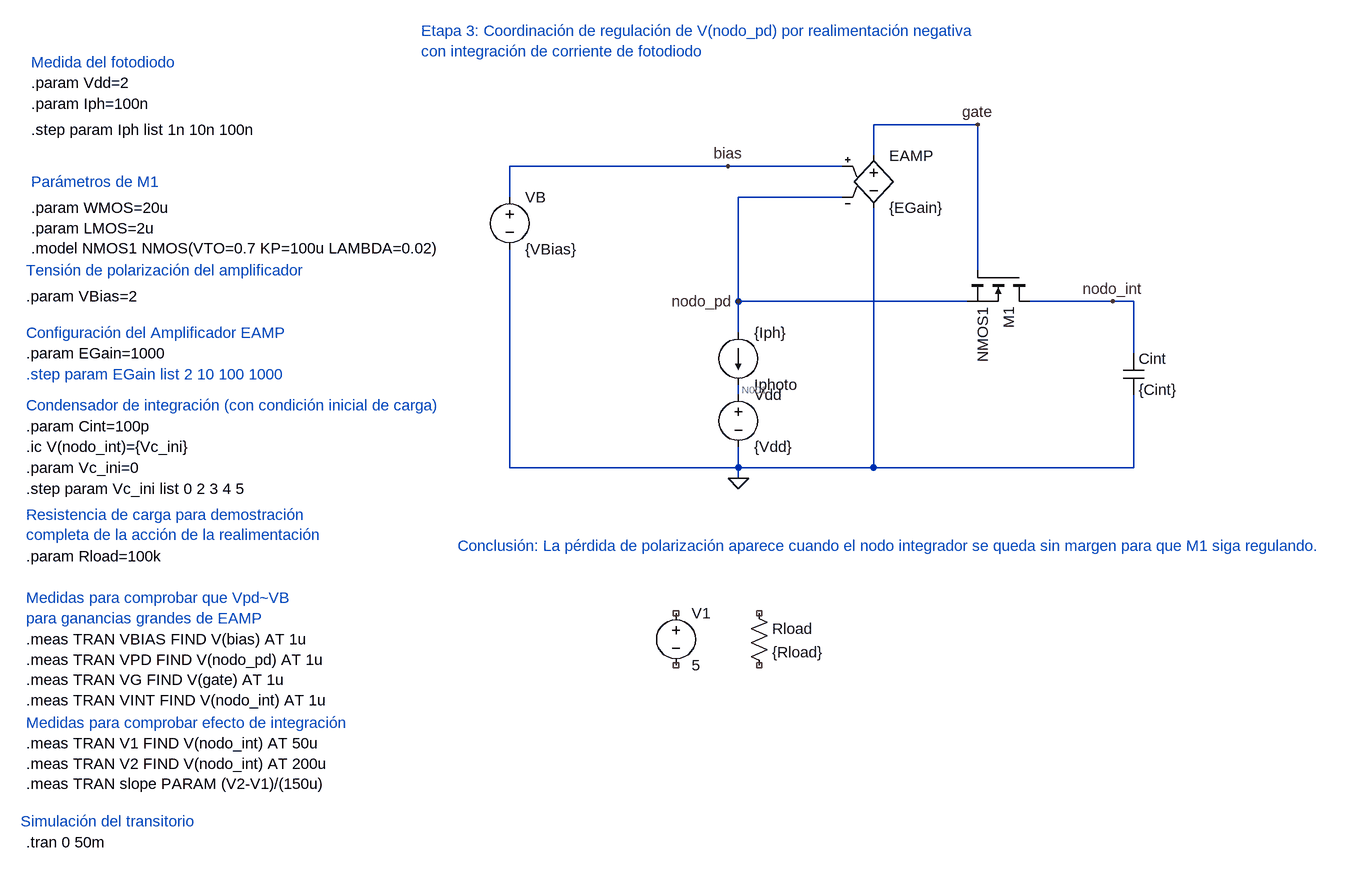
[diagram p0: schematic BDI_Etapa3.asc]
* BDI_Etapa3.asc
EAMP gate 0 bias nodo_pd {EGain}
VB bias 0 {VBias}
Iphoto nodo_pd N001 {Iph}
M1 nodo_int gate nodo_pd nodo_pd NMOS1 L={LMOS} W={WMOS}
Vdd N001 0 {Vdd}
Cint nodo_int 0 {Cint}
Rload NC_01 NC_02 {Rload}
V1 NC_03 NC_04 5
.model NMOS NMOS
.model PMOS PMOS
.lib standard.mos
* Etapa 3: Coordinación de regulación de V(nodo_pd) por realimentación negativa
* con integración de corriente de fotodiodo
.param Iph=100n
* Medida del fotodiodo
.step param Iph list 1n 10n 100n
.param WMOS=20u
.param LMOS=2u
.model NMOS1 NMOS(VTO=0.7 KP=100u LAMBDA=0.02)
* Parámetros de M1
.param VBias=2
* Tensión de polarización del amplificador
* Medidas para comprobar que Vpd~VB
* para ganancias grandes de EAMP
.tran 0 50m
.meas TRAN VBIAS FIND V(bias) AT 1u
.meas TRAN VPD FIND V(nodo_pd) AT 1u
.meas TRAN VG FIND V(gate) AT 1u
.meas TRAN VINT FIND V(nodo_int) AT 1u
.param Vdd=2
.param EGain=1000
* .step param EGain list 2 10 100 1000
* Configuración del Amplificador EAMP
.ic V(nodo_int)={Vc_ini}
* Condensador de integración (con condición inicial de carga)
.param Cint=100p
.meas TRAN V1 FIND V(nodo_int) AT 50u
.meas TRAN V2 FIND V(nodo_int) AT 200u
.meas TRAN slope PARAM (V2-V1)/(150u)
* Medidas para comprobar efecto de integración
* Resistencia de carga para demostración
* completa de la acción de la realimentación
.param Rload=100k
* Simulación del transitorio
.param Vc_ini=0
.step param Vc_ini list 0 2 3 4 5
* Conclusión: La pérdida de polarización aparece cuando el nodo integrador se queda sin margen para que M1 siga regulando.
.backanno
.end

* Results of the author's LTspice run, read from the files saved beside the schematic
* Operating Point (first step), zero values left out:
*   V(bias) = 2 V
*   V(gate) = 2 kV
*   V(n001) = 2 V
*   I(Iphoto) = 1 nA
*   I(Vdd) = 1 nA
*   Id(M1) = 1 nA
*   Is(M1) = -1 nA
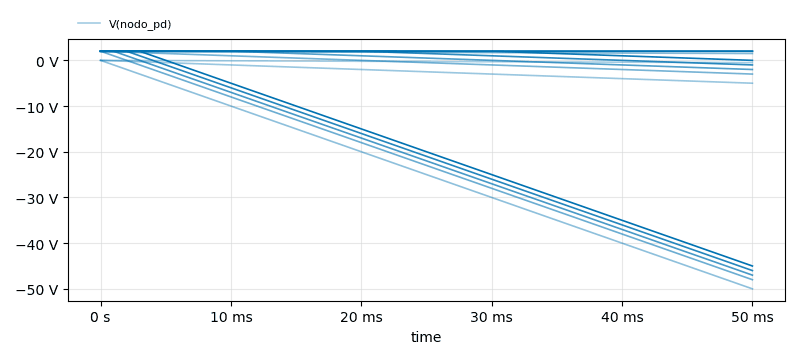
[diagram p1: Transient Analysis of BDI_Etapa3.asc, plotted from the saved traces]
* Transient Analysis, 15 runs:
*   V(nodo_pd) [iph=1e-09 vc_ini=0]: min -499.9 mV, max 0 V, average -250 mV, rms 288.6 mV, last -499.9 mV
*   V(nodo_pd) [iph=1e-08 vc_ini=0]: min -4.999 V, max 0 V, average -2.5 V, rms 2.886 V, last -4.999 V
*   V(nodo_pd) [iph=1e-07 vc_ini=0]: min -49.99 V, max 0 V, average -25 V, rms 28.86 V, last -49.99 V
*   V(nodo_pd) [iph=1e-09 vc_ini=2]: min 1.499 V, max 1.997 V, average 1.75 V, rms 1.755 V, last 1.499 V
*   V(nodo_pd) [iph=1e-08 vc_ini=2]: min -3 V, max 1.997 V, average -500.1 mV, rms 1.527 V, last -3 V
*   V(nodo_pd) [iph=1e-07 vc_ini=2]: min -47.99 V, max 1.997 V, average -23 V, rms 27.15 V, last -47.99 V
*   V(nodo_pd) [iph=1e-09 vc_ini=3]: min 1.997 V, max 1.997 V, average 1.997 V, rms 1.997 V, last 1.997 V
*   V(nodo_pd) [iph=1e-08 vc_ini=3]: min -2 V, max 1.997 V, average 399.2 mV, rms 1.365 V, last -2 V
* From the log:
*   Measurement: vbias
*     step  V(bias)   at
*        1  2  1e-06
*        2  2  1e-06
*        3  2  1e-06
*        4  2  1e-06
*        5  2  1e-06
*        6  2  1e-06
*        7  2  1e-06
*        8  2  1e-06
*        9  2  1e-06
*       10  2  1e-06
*       11  2  1e-06
*       12  2  1e-06
*       13  2  1e-06
*       14  2  1e-06
*       15  2  1e-06
*   Measurement: vpd
*     step  V(nodo_pd)   at
*        1  -1.00004999947e-05  1e-06
*        2  -0.000100005003585  1e-06
*        3  -0.0010000499922  1e-06
*        4  1.9973013401  1e-06
*        5  1.99729752541  1e-06
*        6  1.99724495411  1e-06
*        7  1.9973013401  1e-06
*        8  1.99729824066  1e-06
*        9  1.99728870392  1e-06
*       10  1.9973013401  1e-06
*       11  1.99729835987  1e-06
*       12  1.99728882313  1e-06
*       13  1.9973013401  1e-06
*       14  1.99729835987  1e-06
*       15  1.99728894234  1e-06
*   Measurement: vg
*     step  V(gate)   at
*        1  2000.01000977  1e-06
*        2  2000.09997559  1e-06
*        3  2001  1e-06
*        4  2.69871544838  1e-06
*        5  2.70244121552  1e-06
*        6  2.75510501878  1e-06
*        7  2.69870018959  1e-06
*        8  2.70172572136  1e-06
*        9  2.71129107475  1e-06
*       10  2.69868516922  1e-06
*       11  2.7016825676  1e-06
*       12  2.71115589142  1e-06
*       13  2.69867086411  1e-06
*       14  2.70164060593  1e-06
*       15  2.71102428436  1e-06
*   Measurement: vint
*     step  V(nodo_int)   at
*        1  -9.99999977263e-06  1e-06
*        2  -9.99999977263e-05  1e-06
*        3  -0.00100000005002  1e-06
*        4  1.99998998642  1e-06
*        5  1.99989998341  1e-06
*        6  1.99899995327  1e-06
*        7  2.99998998642  1e-06
*        8  2.9998998642  1e-06
*        9  2.99900007248  1e-06
*       10  3.99998998642  1e-06
*       11  3.9998998642  1e-06
*       12  3.99900007248  1e-06
*       13  4.99998998642  1e-06
*       14  4.9998998642  1e-06
*       15  4.99900007248  1e-06
*   Measurement: v1
*     step  V(nodo_int)   at
*        1  -0.00049999986494  5e-05
*        2  -0.00499999863485  5e-05
*        3  -0.0499999866686  5e-05
*        4  1.99949901551  5e-05
*        5  1.99499900638  5e-05
*        6  1.94999903428  5e-05
*        7  2.99949857592  5e-05
*        8  2.99499842523  5e-05
*        9  2.94999854254  5e-05
*       10  3.99949796498  5e-05
*       11  3.9949980527  5e-05
*       12  3.9499980359  5e-05
*       13  4.99949756265  5e-05
*       14  4.99499768017  5e-05
*       15  4.94999766337  5e-05
*   Measurement: v2
*     step  V(nodo_int)   at
*        1  -0.00199999806495  0.0002
*        2  -0.0199999799681  0.0002
*        3  -0.19999979463  0.0002
*        4  1.99799599777  0.0002
*        5  1.97999600633  0.0002
*        6  1.79999623462  0.0002
*        7  2.99799395439  0.0002
*        8  2.97999399992  0.0002
*        9  2.79999421683  0.0002
*       10  3.9979919622  0.0002
*       11  3.97999195654  0.0002
*       12  3.79999217345  0.0002
*       13  4.99799010605  0.0002
*       14  4.97998991316  0.0002
*       15  4.79999036849  0.0002
*   Measurement: slope
*     step  (V2-V1)/(150u)
*        1  -9.99998800006
*        2  -99.9998755553
*        3  -999.998719746
*        4  -10.0201182548
*        5  -100.020000306
*        6  -1000.0186644
*        7  -10.0308102313
*        8  -100.029502066
*        9  -1000.02883804
*       10  -10.0400184973
*       11  -100.040641077
*       12  -1000.03908299
*       13  -10.0497106576
*       14  -100.051780088
*       15  -1000.04863254